# Altium schematic sheet User_Interface.SchDoc
size A1; SheetNumber: 1; SheetTotal: 1
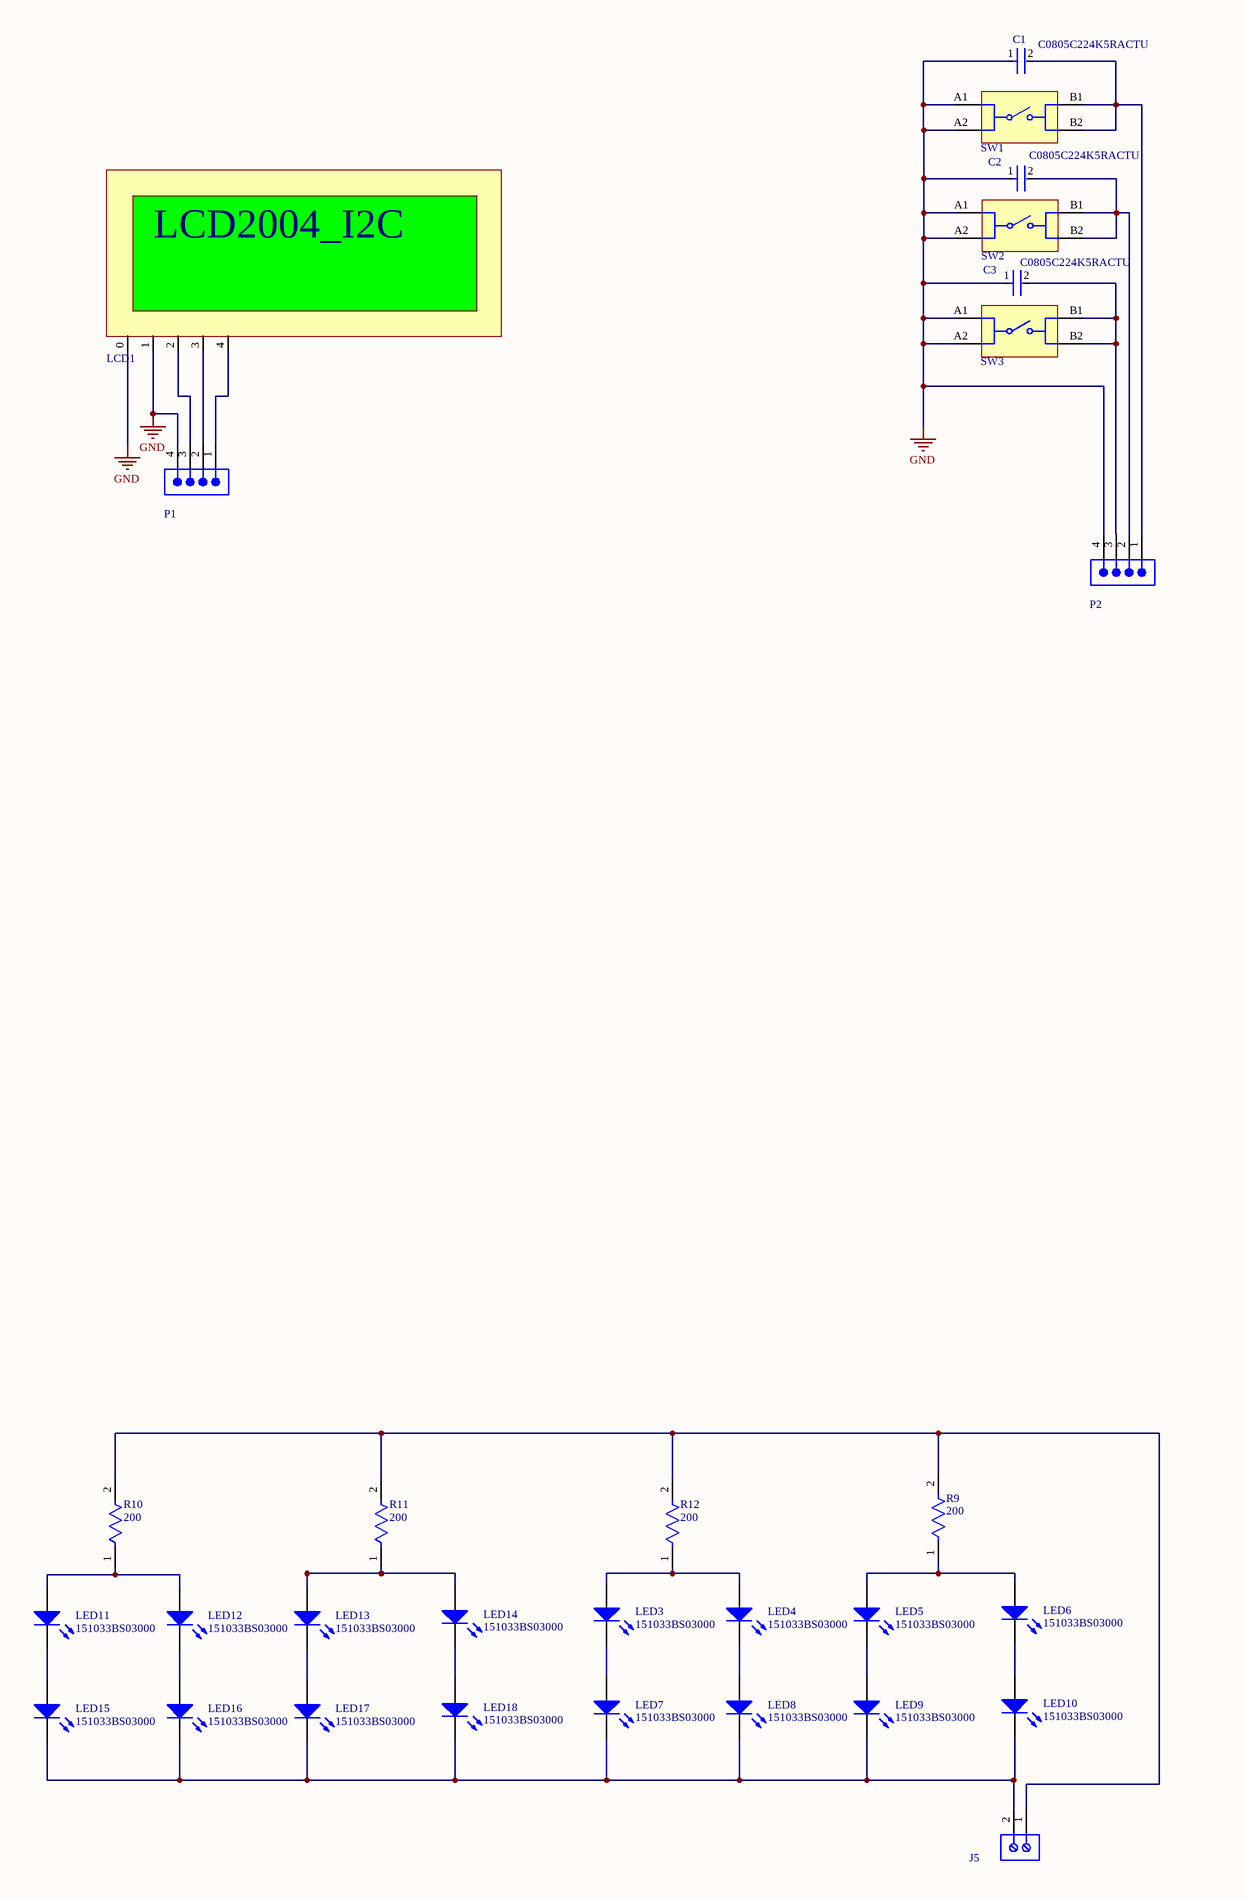
[diagram p0: User_Interface.SchDoc, left]
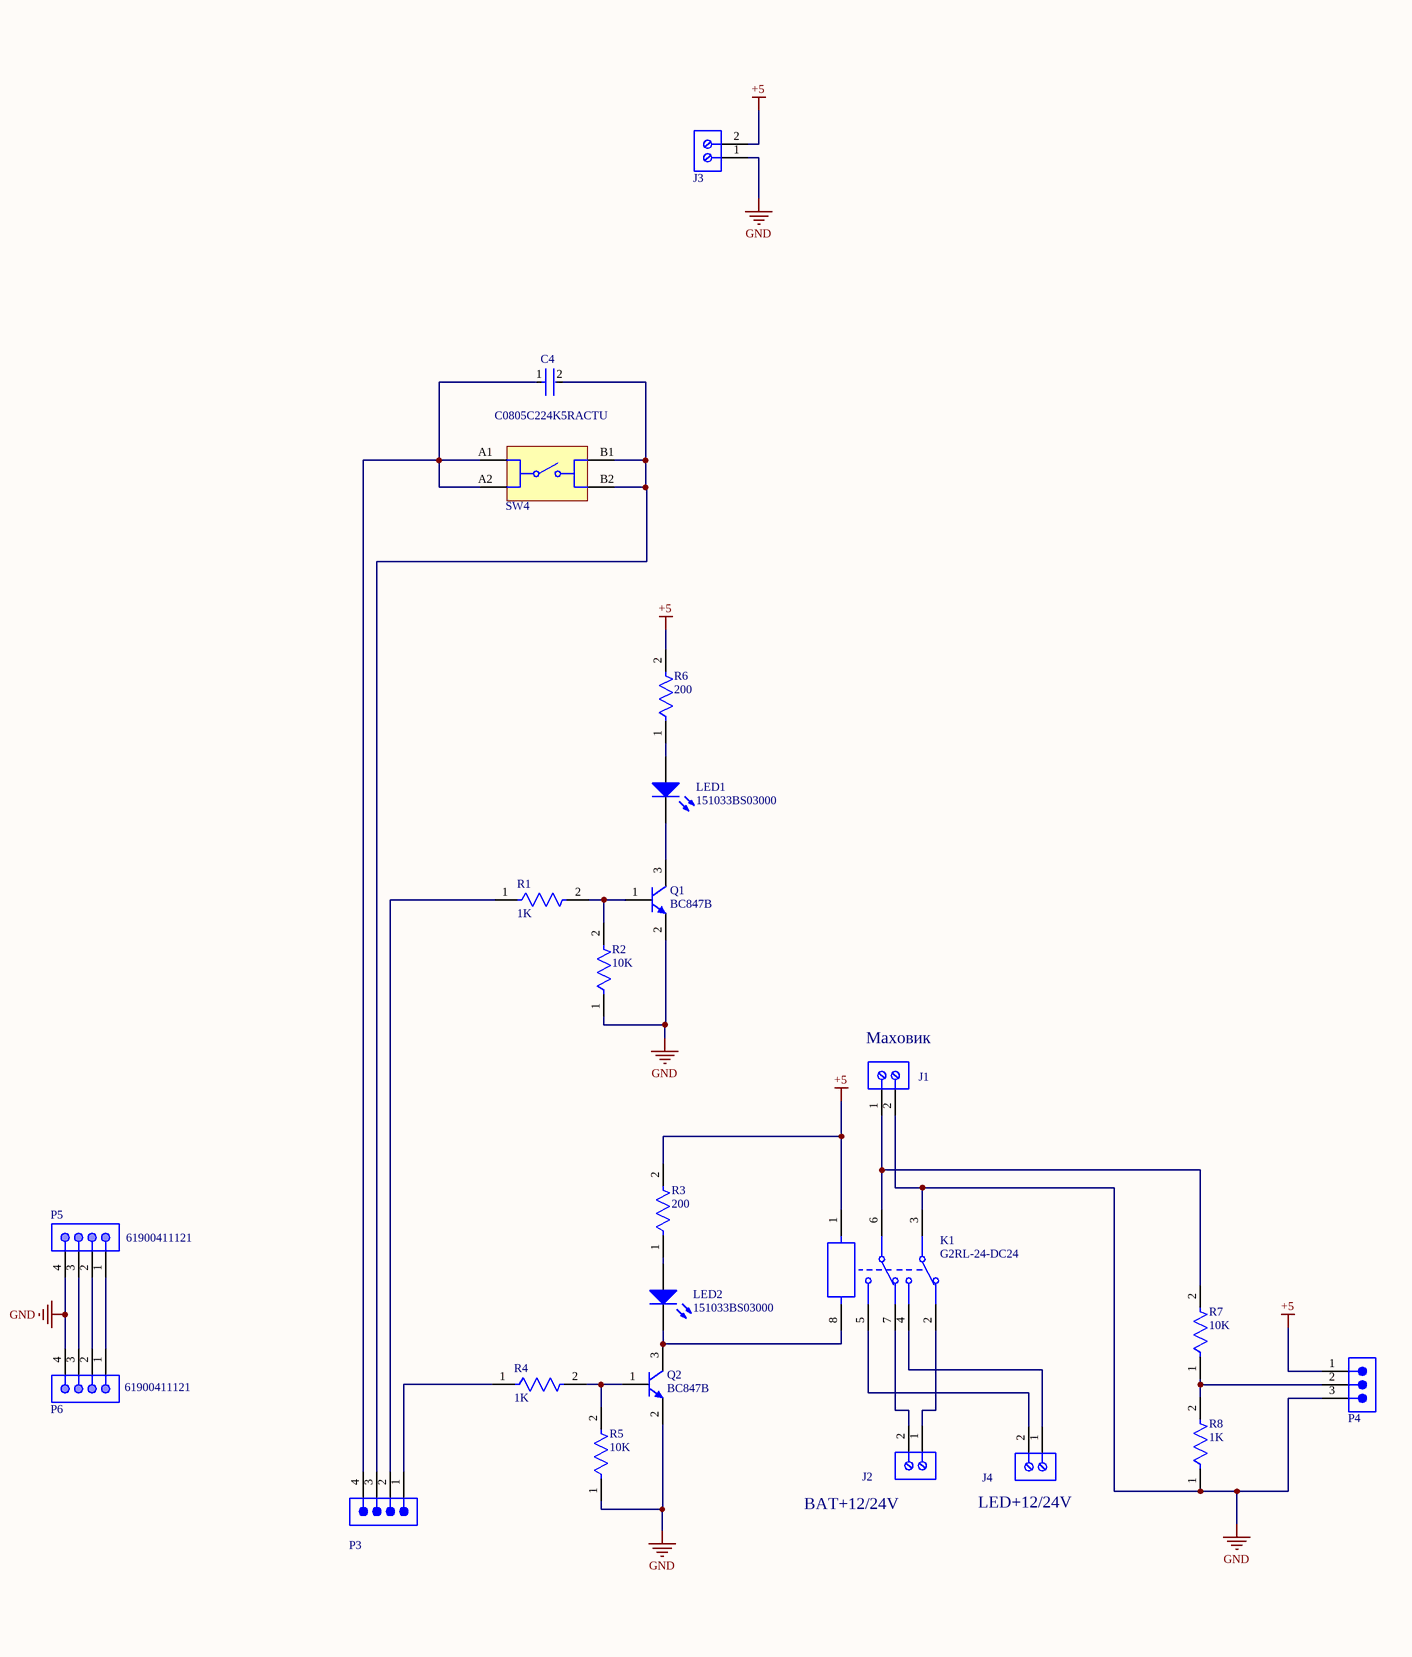
[diagram p1: User_Interface.SchDoc, right]

## Parts
C1  C0805C224K5RACTU  [FP-C0805C-DN-IPC_A]
C2  C0805C224K5RACTU  [FP-C0805C-DN-IPC_A]
C3  C0805C224K5RACTU  [FP-C0805C-DN-IPC_A]
C4  C0805C224K5RACTU  [FP-C0805C-DN-IPC_A]
J1  691101710002  [691101710002]  (value not drawn)
J2  691101710002  [691101710002]  (value not drawn)
J3  691101710002  [691101710002]  (value not drawn)
J4  691101710002  [691101710002]  (value not drawn)
J5  691101710002  [691101710002]  (value not drawn)
K1  G2RL-24-DC24  [OMRON-G2RL-24_V]
LCD1  2004_I2C  [LCD2004_I2C]  (value not drawn)
LED1  151033BS03000  [Type 3mm]
LED2  151033BS03000  [Type 3mm]
LED3  151033BS03000  [Type 3mm]
LED4  151033BS03000  [Type 3mm]
LED5  151033BS03000  [Type 3mm]
LED6  151033BS03000  [Type 3mm]
LED7  151033BS03000  [Type 3mm]
LED8  151033BS03000  [Type 3mm]
LED9  151033BS03000  [Type 3mm]
LED10  151033BS03000  [Type 3mm]
LED11  151033BS03000  [Type 3mm]
LED12  151033BS03000  [Type 3mm]
LED13  151033BS03000  [Type 3mm]
LED14  151033BS03000  [Type 3mm]
LED15  151033BS03000  [Type 3mm]
LED16  151033BS03000  [Type 3mm]
LED17  151033BS03000  [Type 3mm]
LED18  151033BS03000  [Type 3mm]
P1  61900411121  [61900411121]  (value not drawn)
P2  61900411121  [61900411121]  (value not drawn)
P3  61900411121  [61900411121]  (value not drawn)
P4  61900311121  [61900311121]  (value not drawn)
P5  61900411121  [61900411121]
P6  61900411121  [61900411121]
Q1  BC847B  [INF-SOT23_M]
Q2  BC847B  [INF-SOT23_M]
R1  1K  [FP-CRCW0805-e3-MFG]
R2  10K  [FP-CRCW0805-e3-MFG]
R3  200  [FP-CRCW0805-e3-MFG]
R4  1K  [FP-CRCW0805-e3-MFG]
R5  10K  [FP-CRCW0805-e3-MFG]
R6  200  [FP-CRCW0805-e3-MFG]
R7  10K  [FP-CRCW0805-e3-MFG]
R8  1K  [FP-CRCW0805-e3-MFG]
R9  200  [FP-CRCW0805-e3-MFG]
R10  200  [FP-CRCW0805-e3-MFG]
R11  200  [FP-CRCW0805-e3-MFG]
R12  200  [FP-CRCW0805-e3-MFG]
SW1  430156043726  [4301x60437x6]  (value not drawn)
SW2  430156043726  [4301x60437x6]  (value not drawn)
SW3  430156043726  [4301x60437x6]  (value not drawn)
SW4  430156043726  [4301x60437x6]  (value not drawn)

## Nets
+5: J3.2 K1.1 P4.1 R3.2 R6.2
GND: C1.1 C2.1 C3.1 J1.2 J3.1 K1.3 LCD1.0 LCD1.1 P1.4 P2.4 P4.3 P5.4 P6.4 Q1.2(E) Q2.2(E) R2.1 R5.1 R8.1 SW1.A1 SW1.A2 SW2.A1 SW2.A2 SW3.A1 SW3.A2
NetC1_2: C1.2 P2.1 SW1.B1 SW1.B2
NetC2_2: C2.2 P2.2 SW2.B1 SW2.B2
NetC3_2: C3.2 P2.3 SW3.B1 SW3.B2
NetC4_1: C4.1 P3.4 SW4.A1 SW4.A2
NetC4_2: C4.2 P3.3 SW4.B1 SW4.B2
NetJ1_1: J1.1 K1.6 R7.2
NetJ2_1: J2.1 K1.2
NetJ2_2: J2.2 K1.7
NetJ4_1: J4.1 K1.4
NetJ4_2: J4.2 K1.5
NetJ5_1: J5.1 R9.2 R10.2 R11.2 R12.2
NetJ5_2: J5.2 LED7.1(K) LED8.1(K) LED9.1(K) LED10.1(K) LED15.1(K) LED16.1(K) LED17.1(K) LED18.1(K)
NetK1_8: K1.8 LED2.1(K) Q2.3(C)
NetLCD1_2: LCD1.2 P1.3
NetLCD1_3: LCD1.3 P1.2
NetLCD1_4: LCD1.4 P1.1
NetLED1_1: LED1.1(K) Q1.3(C)
NetLED1_2: LED1.2(A) R6.1
NetLED2_2: LED2.2(A) R3.1
NetLED3_1: LED3.1(K) LED7.2(A)
NetLED3_2: LED3.2(A) LED4.2(A) R12.1
NetLED4_1: LED4.1(K) LED8.2(A)
NetLED5_1: LED5.1(K) LED9.2(A)
NetLED5_2: LED5.2(A) LED6.2(A) R9.1
NetLED6_1: LED6.1(K) LED10.2(A)
NetLED11_1: LED11.1(K) LED15.2(A)
NetLED11_2: LED11.2(A) LED12.2(A) R10.1
NetLED12_1: LED12.1(K) LED16.2(A)
NetLED13_1: LED13.1(K) LED17.2(A)
NetLED13_2: LED13.2(A) LED14.2(A) R11.1
NetLED14_1: LED14.1(K) LED18.2(A)
NetP3_1: P3.1 R4.1
NetP3_2: P3.2 R1.1
NetP4_2: P4.2 R7.1 R8.2
NetP5_1: P5.1 P6.1
NetP5_2: P5.2 P6.2
NetP5_3: P5.3 P6.3
NetQ1_1: Q1.1(B) R1.2 R2.2
NetQ2_1: Q2.1(B) R4.2 R5.2

## Notes on the sheet
- (near J1) Маховик
- (near J2) BAT+12/24V
- (near J4) LED+12/24V

## Library data of the parts
C1-C4 = CMP-1036-04552-2: CAP CER 0.22UF 50V X7R 0805; Manufacturer: KEMET; Value: 0.22 μF; Temperature Coefficient: 30ppm/°C; Material: Ceramic; Tolerance: 0.1; ComponentLink2URL: https://content.kemet.com/datasheets/KEM_C1003_C0G_SMD.pdf; Temperature Characteristic: X7R; Device Class L3: Ceramic Capacitors; Lead Free: Yes; Temperature: -55°C to +125°C; RoHS: TRUE; Capacitance: 0.22 μF; Automotive: No; Octopart: https://octopart.com/c0805c224k5ractu-kemet-144670; Manufacturer Part Number: C0805C224K5RACTU; Temperature Range Low: -55°C; Height: 0.88mm; Device Class L1: Passive Components; Digikey Description: CAP CER 0.22UF 50V X7R 0805; ComponentLink2Description: Datasheet; Mouser Description: CAP CER 0.22UF 50V X7R 0805; Category: Cap; Ipc Land Pattern Name: CAPC200125X78; Temperature Range High: +125°C; Package: C0805C-DN; Device Class L2: Capacitors; Voltage Rating: 50 V
J1-J5 = 691101710002: WR-TBL Series 101 Horizontal Entry Modular, THT, pitch 5mm, 2p; Manufacturer: Wurth Elektronik; Modularity: Yes; Rated Current: 16A; Working Voltage: 250V; ComponentLink1Description: Website Link; ComponentLink1URL: https://www.we-online.com/redexpert/article/691101710002?ad; ComponentLink2Description: Datasheet Link; ComponentLink2URL: https://www.we-online.com/redexpert/spec/691101710002?ad; Manufacturer Part Number: 691101710002; Category: Terminal Blocks; Match Code: WR-TBL; Mount: Through Hole; Operating Temperature Max: 105°C; Operating Temperature Min: -40°C; Packaging: Box; Application: Pressure Clamp; Number of Pins: 2; Number of Rows: 1; Orientation: Horizontal; Pitch: 5mm
K1 = CMP-2000-06305-1: Low Profile Power Relay with 15.7 mm Height, Ideal for Incorporation in Miniature Equipment, 24 V, -40 to 85 degC, 8-Pin THD, RoHS, Bulk; Manufacturer: Omron; Contact Form: DPDT(2FormC); Coil Current: 16.7mA; Coil Type: Non-Latching; Contact Termination: Pin; Brand: OmronElectronics; Power Consumption: 400mW; Coil Voltage: 24V; Coil Resistance: 1.44kOhms; Product: PowerRelays; Series: G2RL-2; Length: 29mm; Factory Pack Quantity: 20; Height: 15.7mm; Mounting Technology: ThroughHole; Product Category: GeneralPurposeRelays; Datasheet URL: http://www.omron.com/ecb/products/pdf/en-g2rl.pdf; Package Description: 8-Pin Through Hole Device, Body 28.8 x 12.5 mm; Manufacturer URL: http://www.omron.com/; Type: HighCurrent; Contact Material: SilverNickel; Package Reference: G2RL-24; Datasheet Version: 03/2016; Width: 12.7mm; Mounting Style: ThroughHole; RoHS: Details
LCD1 = LCD2004_I2C
LED1-LED18 = 151033BS03000: THT LED round mono-color waterclear, WL-TMRW , Blue; Manufacturer: Wuerth Elektronik; ComponentLink1Description: Manufacturer URL; ComponentLink2Description: Datasheet; ComponentLink1URL: http://www.we-online.com; ComponentLink2URL: http://katalog.we-online.de/pbs/datasheet/7448042001.pdfhttp://katalog.we-online.de/pbs/datasheet/7448042001.pdfhttp://katalog.we-online.de/pbs/datasheet/7448042001.pdfhttp://katalog.we-online.de/pbs/datasheet/151033BS03000.pdf; PartNumber: 151033BS03000; Emitting color: Blue; PackageReference: Type 3mm
P1-P3 = 61900411121: WR-WTB THT Male Vertical Locking Header, pitch 2.54mm, 4pins; Manufacturer: Wurth Elektronik; Contact Resistance: 20mΩ; Rated Current: 3A; Working Voltage: 250VAC; Withstanding Voltage: 1000VAC; ComponentLink1Description: Website Link; ComponentLink1URL: https://www.we-online.com/redexpert/article/61900411121?ad; ComponentLink2Description: Datasheet Link; ComponentLink2URL: https://www.we-online.com/redexpert/spec/61900411121?ad; Manufacturer Part Number: 61900411121; Category: Wire-to-Board Connectors; Match Code: WR-WTB; Mount: Through Hole; Operating Temperature Max: 105°C; Operating Temperature Min: -40°C; Packaging: Bag; Length: 10.16mm; Width: 5.8mm; Height: 11.5mm; Gender: Male; Number of Pins: 4; Number of Rows: 1; Orientation: Vertical; Pitch: 2.54mm
P4 = 61900311121: WR-WTB THT Male Vertical Locking Header, pitch 2.54mm, 3pins; Manufacturer: Wurth Elektronik; Contact Resistance: 20mΩ; Rated Current: 3A; Working Voltage: 250VAC; Withstanding Voltage: 1000VAC; ComponentLink1Description: Website Link; ComponentLink1URL: https://www.we-online.com/redexpert/article/61900311121?ad; ComponentLink2Description: Datasheet Link; ComponentLink2URL: https://www.we-online.com/redexpert/spec/61900311121?ad; Manufacturer Part Number: 61900311121; Category: Wire-to-Board Connectors; Match Code: WR-WTB; Mount: Through Hole; Operating Temperature Max: 105°C; Operating Temperature Min: -40°C; Packaging: Bag; Length: 7.62mm; Width: 5.8mm; Height: 11.5mm; Gender: Male; Number of Pins: 3; Number of Rows: 1; Orientation: Vertical; Pitch: 2.54mm
P5 P6 = 61900411121: WR-WTB THT Male Vertical Locking Header, pitch 2.54mm, 4p; Pin Number: 4; Contact Resistance: 20mOhm; Rated Current: 3A; Withstanding Voltage: 1000VAC; Working Voltage: 250VAC; ComponentLink1Description: Manufacturer; ComponentLink1URL: http://www.we-online.de; ComponentLink2Description: Datasheet; ComponentLink2URL: https://www.we-online.com/catalog/datasheet/61900411121.pdf; Pitch: 2.54mm; Published Date: January 2020; Publisher: Wurth Elektronik; Mounting Technology: THT; Packaging: Bag; Operating Temperature: -40 to +105degC; Part Number: 61900411121; Gender: Male; Type: Vertical
Q1 Q2 = CMP-1177-00042-1: NPN Silicon AF Transistor, 45 V VCEO, 100 mA IC, SOT23, Reel, Green; Manufacturer: Infineon; VEBO (max): 6Â V; ICBO (max): 15Â nA; VCBO (max): 50Â V; IBM (max): 200Â mA; Green: TRUE; Ptot (max): 330Â mW; fT (typ): 250Â MHz; IC (max): 100Â mA; VCEO (max): 45Â V; PackageDescription: 3-Pin Small Outline Transistor Package, 1.3 x 2.9 mm Body, 0.95 mm Pitch; ComponentLink3URL: http://www.infineon.com/dgdl/SOT23-Package_Overview.pdf?folderId=db3a30431936bc4b0119532290053c66&fileId=db3a30431936bc4b0119533468123c85; PackageVersion: Apr-08; Packing: Reel; ComponentLink3Description: Package Specification; ComponentLink2URL: http://www.infineon.com/dgdl/bc847series_bc848series_bc849series_bc850series.pdf?folderId=db3a304314dca389011541d30fa21656&fileId=db3a304314dca389011541d4630a1657; ComponentLink1URL: http://www.infineon.com/; ComponentLink2Description: Datasheet; Polarity: NPN; Mounting Technology: Surface Mount; PackageReference: SOT23; ICM (max): 200Â mA; ComponentLink1Description: Manufacturer URL; PartNumber: BC847B
R1 R2 R5 R7 = CMP-2001-04908-2: RES Thick Film, 10kΩ, 1%, 0.125W, 100ppm/°C, 0805; Resistance: 10kR; Voltage Rating (DC): 150V; Power Rating: 125mW; Weight: 0.000194oz; Package Quantity: 5000; Military Standard: Not; Max Operating Temperature: 155°C; Temperature Coefficient: 100ppm/°C; Contact Plating: Tin; Width: 1.25mm; Height: 0.45mm; Radiation Hardening: No; Tolerance: 1%; Min Operating Temperature: -55°C; Voltage Rating: 150V; Length: 2mm; Depth: 1.25mm; Termination: SMD/SMT; Packaging: Tape and Reel; Case/Package: 0805; Case Code (Metric): 2012; Lead Free: Lead Free; Case Code (Imperial): 0805; Composition: Thick Film
R3 R6 R9-R12 = CMP-2001-04908-2: RES Thick Film, 200Ω, 1%, 0.125W, 100ppm/°C, 0805; Resistance: 10kR; Voltage Rating (DC): 150V; Power Rating: 125mW; Weight: 0.000194oz; Package Quantity: 5000; Military Standard: Not; Max Operating Temperature: 155°C; Temperature Coefficient: 100ppm/°C; Contact Plating: Tin; Width: 1.25mm; Height: 0.45mm; Radiation Hardening: No; Tolerance: 1%; Min Operating Temperature: -55°C; Voltage Rating: 150V; Length: 2mm; Depth: 1.25mm; Termination: SMD/SMT; Packaging: Tape and Reel; Case/Package: 0805; Case Code (Metric): 2012; Lead Free: Lead Free; Case Code (Imperial): 0805; Composition: Thick Film
R4 R8 = CMP-2001-04908-2: RES Thick Film, 1kΩ, 1%, 0.125W, 100ppm/°C, 0805; Resistance: 10kR; Voltage Rating (DC): 150V; Power Rating: 125mW; Weight: 0.000194oz; Package Quantity: 5000; Military Standard: Not; Max Operating Temperature: 155°C; Temperature Coefficient: 100ppm/°C; Contact Plating: Tin; Width: 1.25mm; Height: 0.45mm; Radiation Hardening: No; Tolerance: 1%; Min Operating Temperature: -55°C; Voltage Rating: 150V; Length: 2mm; Depth: 1.25mm; Termination: SMD/SMT; Packaging: Tape and Reel; Case/Package: 0805; Case Code (Metric): 2012; Lead Free: Lead Free; Case Code (Imperial): 0805; Composition: Thick Film
SW1-SW4 = 430156043726: WS-TATV THT Tact Switch 6x6mm, SPST-NO, 12VDC, 50mA, 260g; Manufacturer: Wurth Elektronik; Washable: No; ComponentLink1Description: Website Link; ComponentLink1URL: https://www.we-online.com/redexpert/article/430156043726?ad; ComponentLink2Description: Datasheet Link; ComponentLink2URL: https://www.we-online.com/redexpert/spec/430156043726?ad; Manufacturer Part Number: 430156043726; Category: Tact Switches; Match Code: WS-TATV; Mount: Through Hole; Operating Temperature Max: 85°C; Operating Temperature Min: -40°C; Packaging: Bulk; Length: 6mm; Width: 6mm; Height: 4.3mm; Circuit: SPST-NO; Contact Material: Stainless Steel; Contact Plating: Silver; Operation Force: 260g; Rated Current: 50mA; Rated Voltage: 12VDC; Terminal Material: Copper Alloy; Terminal Plating: Silver